# EAGLE design SIM908 (EAGLE 7.4.0)
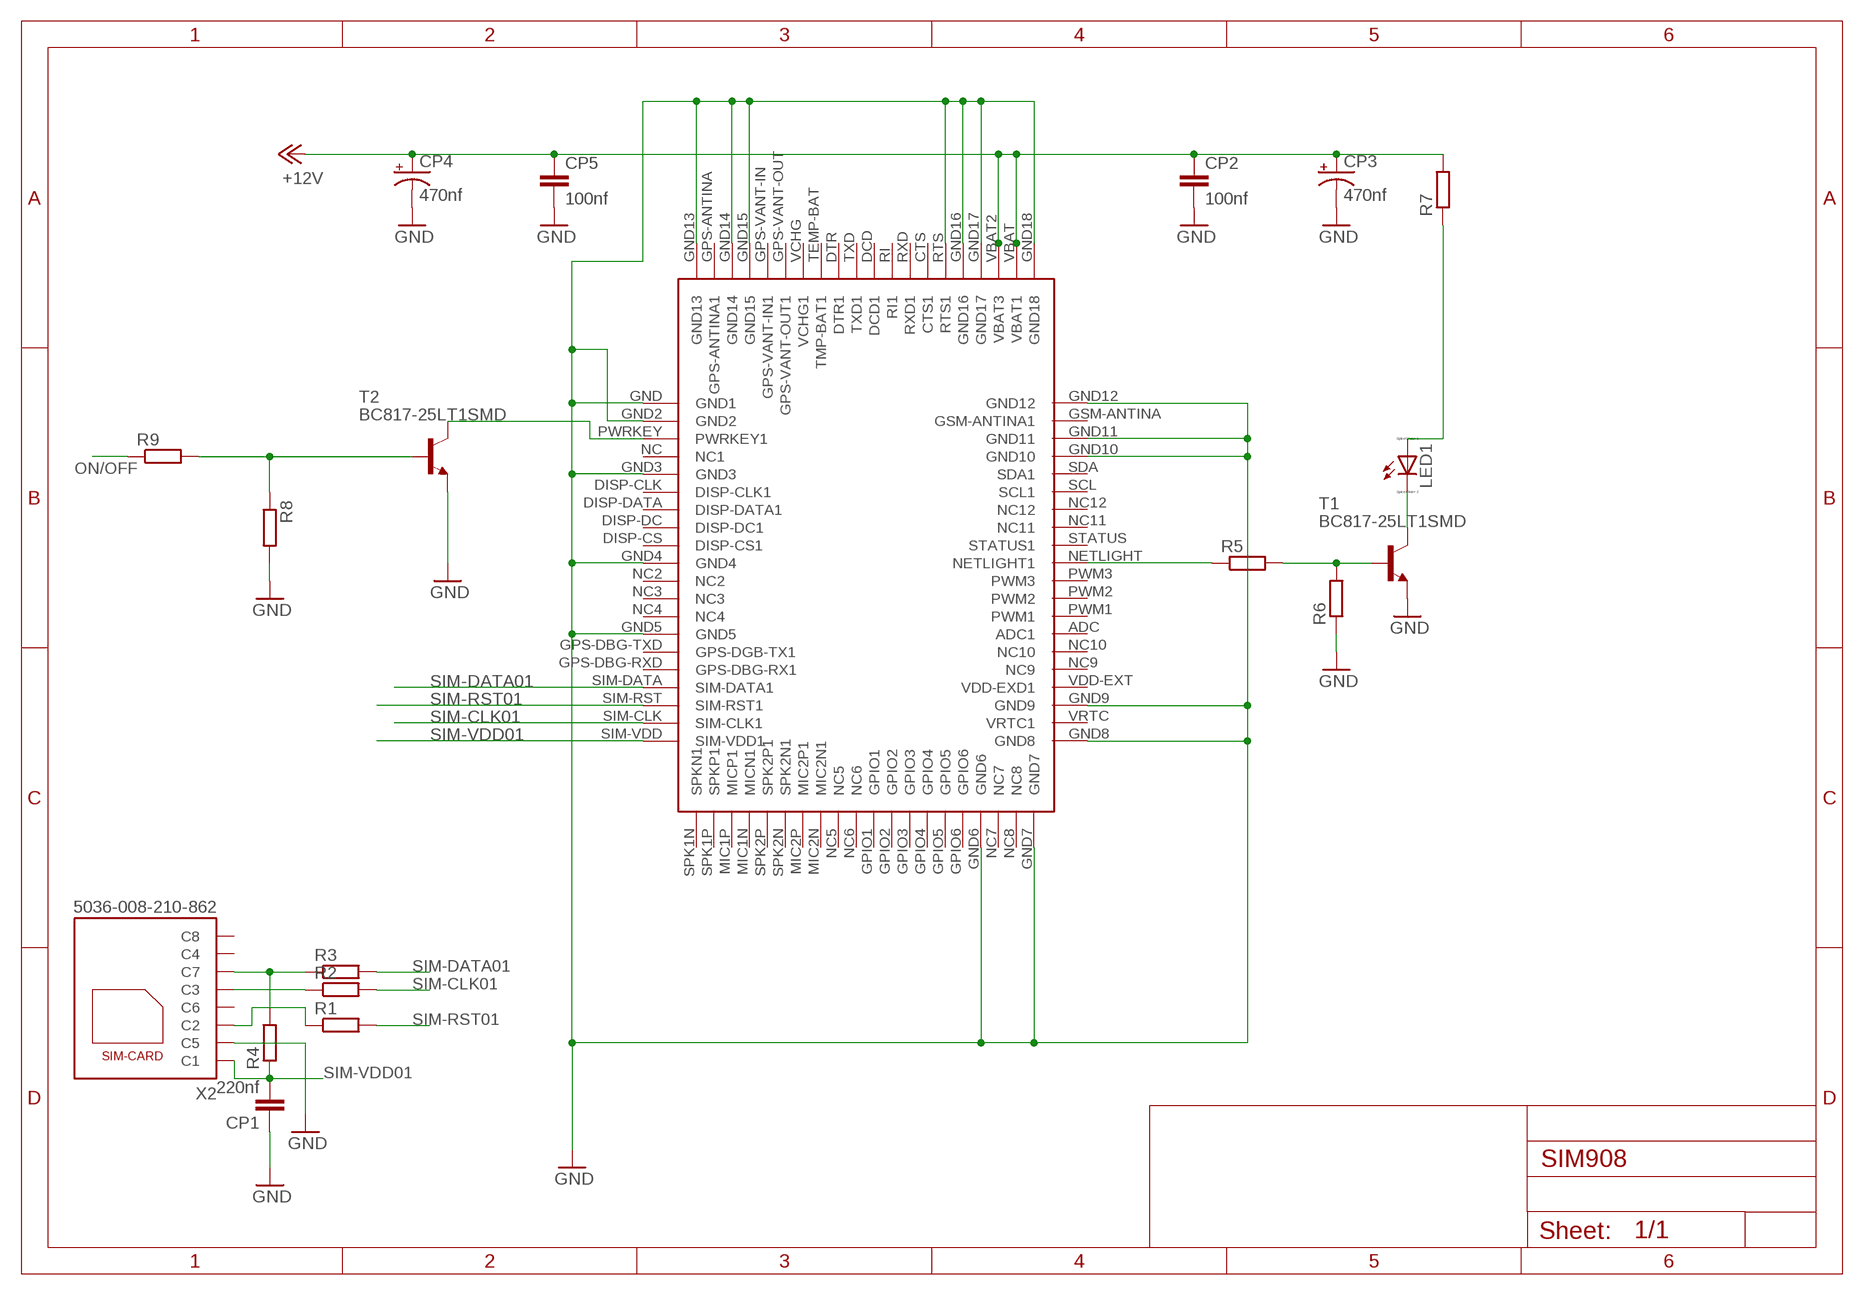
[diagram p0: schematic, sheet 1]

## Parts
CP1  220nf  C15/9  [C15B9]
CP2  100nf  C15/9  [C15B9]
CP3  470nf  CPOL-US153CLV-0807  [153CLV-0807]
CP4  470nf  CPOL-US153CLV-0807  [153CLV-0807]
CP5  100nf  C15/9  [C15B9]
LED1  LED_E  [LED_1206]
R1  R-EU_0207/12  [0207/12]
R2  R-EU_0207/12  [0207/12]
R3  R-EU_0207/12  [0207/12]
R4  R-EU_0207/12  [0207/12]
R5  R-EU_0207/12  [0207/12]
R6  R-EU_0207/12  [0207/12]
R7  R-EU_0207/12  [0207/12]
R8  R-EU_0207/12  [0207/12]
R9  R-EU_0207/12  [0207/12]
T1  BC817-25LT1SMD  [SOT23-BEC]
T2  BC817-25LT1SMD  [SOT23-BEC]
U$2  SIM908  [SIM908]
X2  5036-008-210-862  [5036_008_210_862]

## Nets
+12V: CP2.1 CP3.+ CP4.+ CP5.1 R7.2 U$2.VBAT2(VBAT3) U$2.VBAT(VBAT1)
GND: CP1.1 CP2.2 CP3.- CP4.- CP5.2 R6.1 R8.2 T1.E T2.E U$2.GND2 U$2.GND3 U$2.GND4 U$2.GND5 U$2.GND6 U$2.GND7 U$2.GND8 U$2.GND9 U$2.GND10 U$2.GND11 U$2.GND12 U$2.GND13 U$2.GND14 U$2.GND15 U$2.GND16 U$2.GND17 U$2.GND18 U$2.GND(GND1) U$2.RTS(RTS1) X2.C5
N$7: R2.1 X2.C3
N$9: R3.1 R4.2 X2.C7
N$10: R1.1 X2.C2
N$11: T2.C U$2.PWRKEY(PWRKEY1)
N$14: R8.1 R9.2 T2.B
N$16: R5.2 R6.2 T1.B
N$17: LED1.C T1.C
N$18: LED1.A R7.1
N$19: R5.1 U$2.NETLIGHT(NETLIGHT1)
ON/OFF: R9.1
SIM-CLK01: R2.2 U$2.SIM-CLK(SIM-CLK1)
SIM-DATA01: R3.2 U$2.SIM-DATA(SIM-DATA1)
SIM-RST01: R1.2 U$2.SIM-RST(SIM-RST1)
SIM-VDD01: CP1.2 R4.1 U$2.SIM-VDD(SIM-VDD1) X2.C1
Unconnected: U$2.ADC(ADC1) U$2.CTS(CTS1) U$2.DCD(DCD1) U$2.DISP-CLK(DISP-CLK1) U$2.DISP-CS(DISP-CS1) U$2.DISP-DATA(DISP-DATA1) U$2.DISP-DC(DISP-DC1) U$2.DTR(DTR1) U$2.GPIO1 U$2.GPIO2 U$2.GPIO3 U$2.GPIO4 U$2.GPIO5 U$2.GPIO6 U$2.GPS-ANTINA(GPS-ANTINA1) U$2.GPS-DBG-RXD(GPS-DBG-RX1) U$2.GPS-DBG-TXD(GPS-DGB-TX1) U$2.GPS-VANT-IN(GPS-VANT-IN1) U$2.GPS-VANT-OUT(GPS-VANT-OUT1) U$2.GSM-ANTINA(GSM-ANTINA1) U$2.MIC1N(MICN1) U$2.MIC1P(MICP1) U$2.MIC2N(MIC2N1) U$2.MIC2P(MIC2P1) U$2.NC2 U$2.NC3 U$2.NC4 U$2.NC5 U$2.NC6 U$2.NC7 U$2.NC8 U$2.NC9 U$2.NC10 U$2.NC11 U$2.NC12 U$2.NC(NC1) U$2.PWM1 U$2.PWM2 U$2.PWM3 U$2.RI(RI1) U$2.RXD(RXD1) U$2.SCL(SCL1) U$2.SDA(SDA1) U$2.SPK1N(SPKN1) U$2.SPK1P(SPKP1) U$2.SPK2N(SPK2N1) U$2.SPK2P(SPK2P1) U$2.STATUS(STATUS1) U$2.TEMP-BAT(TMP-BAT1) U$2.TXD(TXD1) U$2.VCHG(VCHG1) U$2.VDD-EXT(VDD-EXD1) U$2.VRTC(VRTC1) X2.C4 X2.C6 X2.C8

## Library data of the parts
CP1 CP2 CP5 = capacitor-wima:C: CAPACITOR naming: grid - package width
CP3 CP4 = rcl:CPOL-US: POLARIZED CAPACITOR, American symbol
LED1 = eagle-ltspice:LED_E: LED Source: http://www.osram.convergy.de Source: www.luxeon.com Source: www.kingbright.com; SPICEMODEL: NONE; SPICEPREFIX: D; SPICETYPE: diode
R1-R9 = resistor:R-EU_: RESISTOR, European symbol
T1 T2 = transistor-npn:BC817*: NPN Transistor
U$2 = sim908_-made_by_hardik:SIM908
X2 = con-kyocera-elco:5036-008-210-862: SIM Card Module Source: http://www.kyocera-elco.com/prdct/pdf/5036.pdf; OC_FARNELL: unknown; OC_NEWARK: unknown

## Board
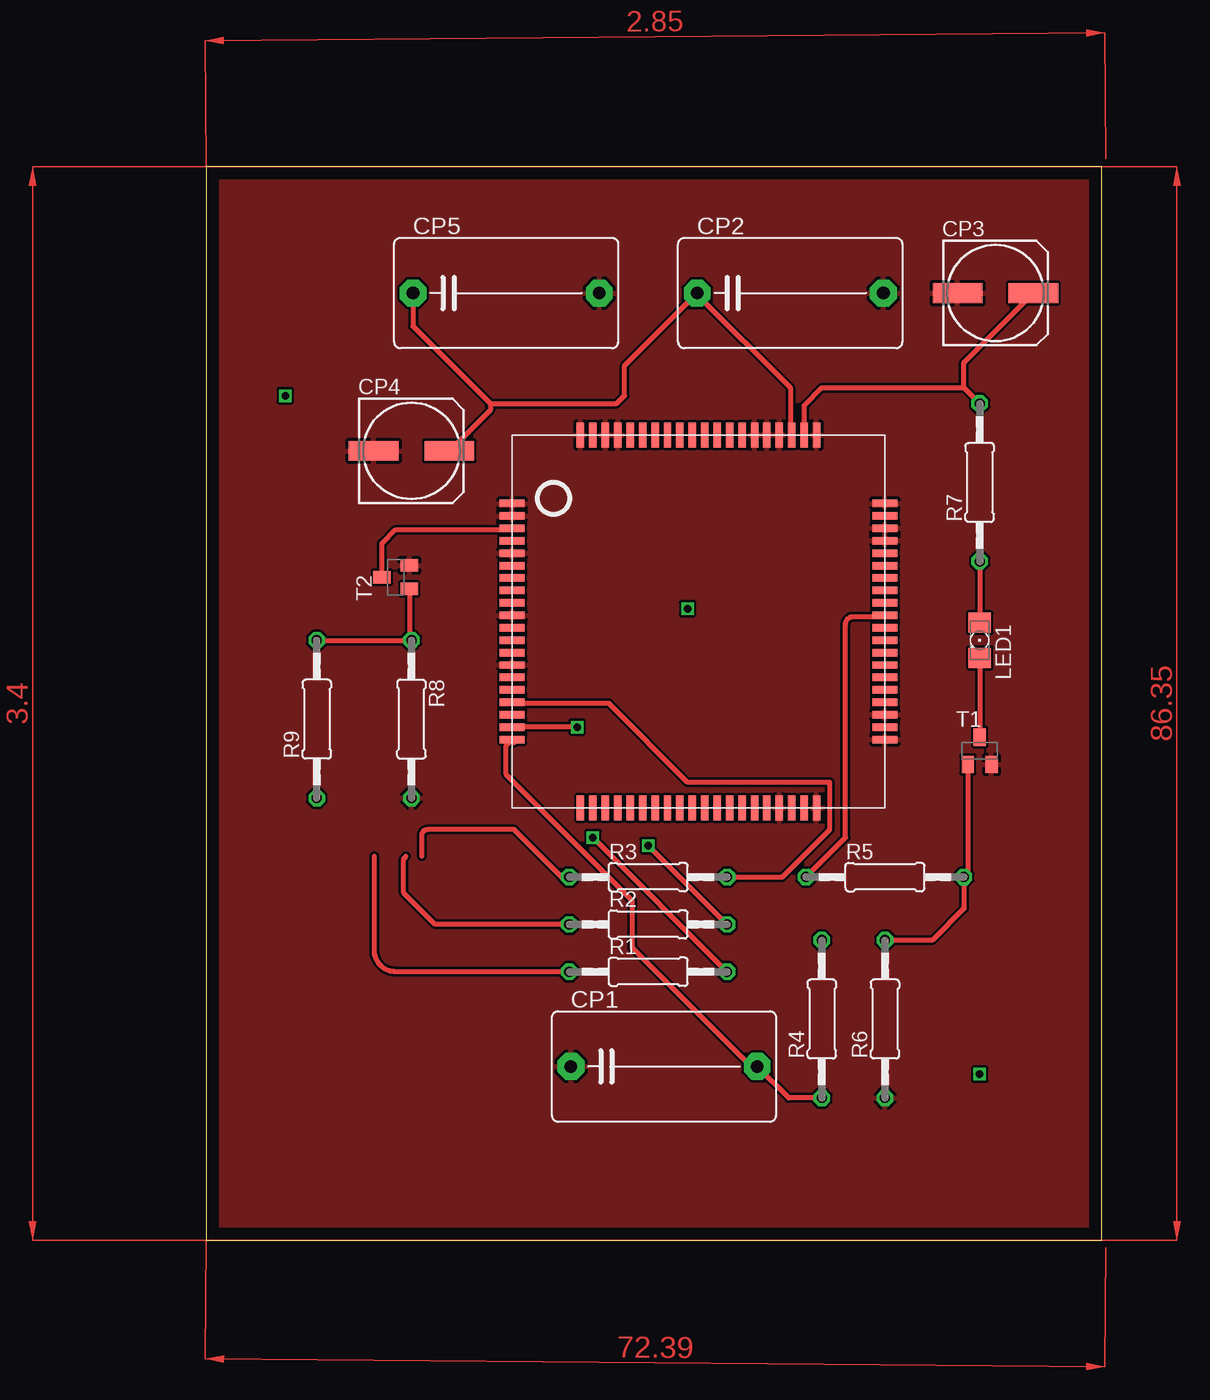
[diagram p1: board, top side]
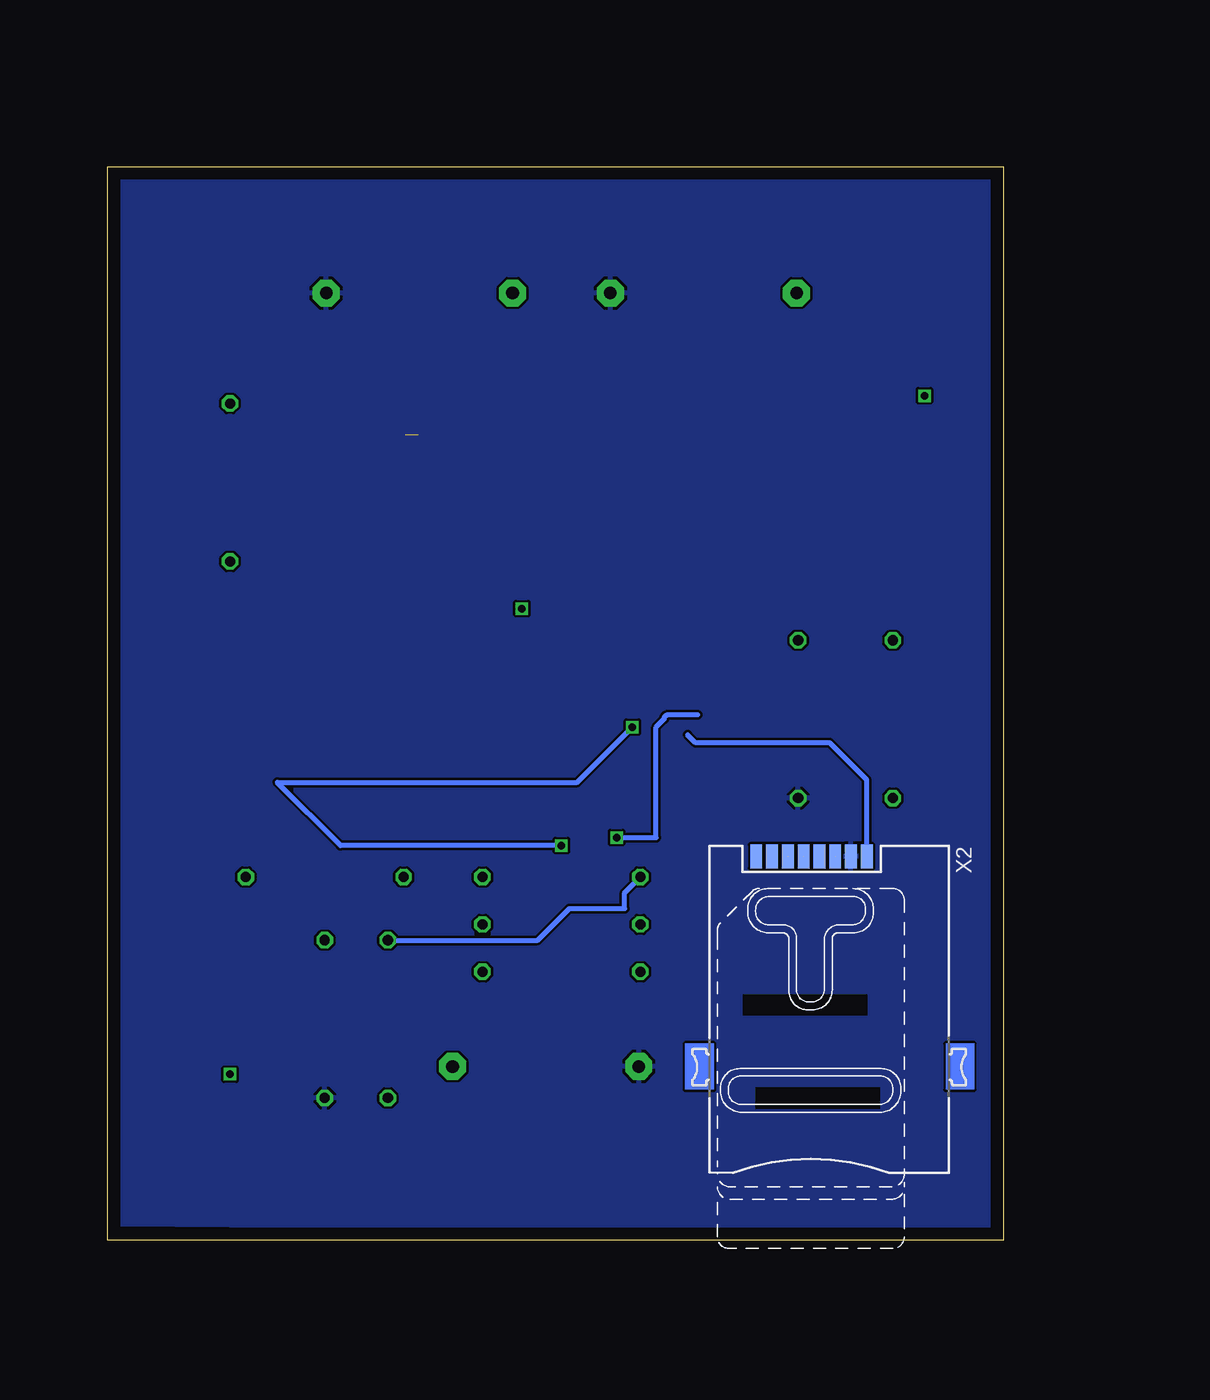
[diagram p2: board, bottom side, seen from below]

Size 72.06 x 86.35 mm. Coordinates in mm from the lower left corner, seen from the top.
Outline: 0,0 72.06,0 72.06,86.35 0,86.35 0,0
Copper layers (1*16): Top 0.035mm / dielectric 1.5mm / Bottom 0.035mm
Design rules "default *": minimum track width 10mil, minimum drill 20mil, track to track 8mil, track to pad 8mil, pad to pad 8mil, via to via 8mil, smd to smd 8mil, copper to edge 40mil, drill to drill 8mil, minimum pad ring 10mil, minimum via ring 8mil, stop-mask expansion 4mil, vias tented up to drill 0mil, thermal gap 10mil

### Footprints (pad centres in the part's own frame; a part is rotated, then mirrored left to right if it is on the bottom)
C15B9 = drill 1.016 pad 2.159 octagon: 1 -7.493,0; 2 7.493,0
153CLV-0807 = smd 4 x 1.6: + 3.05,0; - -3.05,0
LED_1206 = smd 1.6 x 1.803: A -1.422,0; C 1.422,0
0207/12 = drill 0.813 octagon: 1 -6.35,0; 2 6.35,0
SOT23-BEC = smd 1 x 1.4: B -0.95,-1.1; C 0,1.1; E 0.95,-1.1
SIM908 = smd 2 x 0.6: ADC 0,-18.5; DISP-CLK -30,-10.5; DISP-CS -30,-13.5; DISP-DATA -30,-11.5; DISP-DC -30,-12.5; GND -30,-5.5; GND2 -30,-6.5; GND3 -30,-9.5; GND4 -30,-14.5; GND5 -30,-18.5; GND8 0,-24.5; GND9 0,-22.5; GND10 0,-8.5; GND11 0,-7.5; GND12 0,-5.5; GPS-DBG-RXD -30,-20.5; GPS-DBG-TXD -30,-19.5; GSM-ANTINA 0,-6.5; NC -30,-8.5; NC2 -30,-15.5; NC3 -30,-16.5; NC4 -30,-17.5; NC9 0,-20.5; NC10 0,-19.5; NC11 0,-12.5; NC12 0,-11.5; NETLIGHT 0,-14.5; PWM1 0,-17.5; PWM2 0,-16.5; PWM3 0,-15.5; PWRKEY -30,-7.5; SCL 0,-10.5; SDA 0,-9.5; SIM-CLK -30,-23.5; SIM-DATA -30,-21.5; SIM-RST -30,-22.5; SIM-VDD -30,-24.5; STATUS 0,-13.5; VDD-EXT 0,-21.5; VRTC 0,-23.5 | smd 0.6 x 2: CTS -11.5,0; DCD -14.5,0; DTR -16.5,0; GND6 -8.5,-30; GND7 -5.5,-30; GND13 -24.5,0; GND14 -22.5,0; GND15 -21.5,0; GND16 -9.5,0; GND17 -8.5,0; GND18 -5.5,0; GPIO1 -14.5,-30; GPIO2 -13.5,-30; GPIO3 -12.5,-30; GPIO4 -11.5,-30; GPIO5 -10.5,-30; GPIO6 -9.5,-30; GPS-ANTINA -23.5,0; GPS-VANT-IN -20.5,0; GPS-VANT-OUT -19.5,0; MIC1N -21.5,-30; MIC1P -22.5,-30; MIC2N -17.5,-30; MIC2P -18.5,-30; NC5 -16.5,-30; NC6 -15.5,-30; NC7 -7.5,-30; NC8 -6.5,-30; RI -13.5,0; RTS -10.5,0; RXD -12.5,0; SPK1N -24.5,-30; SPK1P -23.5,-30; SPK2N -20.5,-30; SPK2P -19.5,-30; TEMP-BAT -17.5,0; TXD -15.5,0; VBAT -6.5,0; VBAT2 -7.5,0; VCHG -18.5,0
5036_008_210_862 = smd 1.9 x 0.95: C1 -16.9,2.98; C2 -16.9,0.44; C3 -16.9,-2.1; C4 -16.9,-4.64; C5 -16.9,1.71; C6 -16.9,-0.83; C7 -16.9,-3.37; C8 -16.9,-5.91

### Placement (x,y rotation side)
CP1  36.83,13.97 0 top
CP2  46.99,76.2 0 top
CP3  63.5,76.2 0 top
CP4  16.51,63.5 0 top
CP5  24.13,76.2 0 top
LED1  62.23,48.26 270 top
R1  35.56,21.59 0 top
R2  35.56,25.4 0 top
R3  35.56,29.21 0 top
R4  49.53,17.78 90 top
R5  54.61,29.21 0 top
R6  54.61,17.78 90 top
R7  62.23,60.96 90 top
R8  16.51,41.91 270 top
R9  8.89,41.91 90 top
T1  62.23,39.37 0 top
T2  15.24,53.34 90 top
U$2  54.61,64.77 0 top
X2  13.97,13.97 270 bottom

### Tracks (layer width: path | path; a pad name or v marks a point on that pad's centre or on a via)
+12V  (1 unrouted)
  Top 0.406: CP5.1 16.64,73.53 22.86,67.31 | 22.86,67.31 22.86,66.8 CP4.+ | 22.86,67.31 33.02,67.31 33.66,67.95 33.66,70.36 CP2.1 39.5,76.07 46.99,68.58 46.99,64.89 U$2.VBAT2 | U$2.VBAT 48.11,67.16 49.53,68.58 60.96,68.58 | 60.96,68.58 R7.2 | 60.96,68.58 60.96,70.61 CP3.+
GND
  Bottom 0.406: X2.C5 12.26,30.68 12.07,30.48
  pour Top: -29.21,92.71 123.19,92.71 123.19,29.21 123.19,-6.35 -29.21,-6.35
  pour Bottom: -0.63,85.73 0,0.63 71.12,1.27 72.39,87
N$1  (via drill 0.6)
  other vias: 62.23,13.34
N$2  (via drill 0.6)
  other vias: 38.73,50.8
N$3  (via drill 0.6)
  other vias: 6.35,67.95
N$7  (1 unrouted)
  Top 0.406: R2.1 18.41,25.4 15.88,27.94 15.88,30.68 X2.C3
N$9  (1 unrouted)
  Top 0.406: R3.1 28.57,29.21 24.77,33.02 17.78,33.02 arc90 17.34,32.58 X2.C7
  Bottom 0.406: R4.2 37.47,24.13 34.92,26.67 30.48,26.67 30.48,27.94 R3.1
N$10  (1 unrouted)
  Top 0.406: R1.1 15.24,21.59 arc-90 13.53,23.3 X2.C2
N$11
  Top 0.406: T2.C 14.14,56.05 15.24,57.15 24.49,57.15 U$2.PWRKEY
N$14
  Top 0.406: T2.B 16.34,48.43 R8.1 R9.2
N$16
  Top 0.406: T1.B 61.28,29.53 R5.2 60.96,26.67 58.42,24.13 R6.2
N$17
  Top 0.406: LED1.C T1.C
N$18
  Top 0.406: R7.1 LED1.A
N$19
  Top 0.406: R5.1 51.44,32.38 51.44,49.53 arc-90 52.07,50.16 53.97,50.16 arc-90 54.08,50.27 U$2.NETLIGHT
SIM-CLK01  (via drill 0.6)
  Top 0.406: R2.2 v35.56,31.75 | v29.85,41.27 U$2.SIM-CLK
  Bottom 0.406: v35.56,31.75 53.34,31.75 58.42,36.83 34.29,36.83 v29.85,41.27
SIM-DATA01
  Top 0.406: R3.2 46.36,29.21 50.17,33.02 50.17,36.83 38.73,36.83 32.39,43.18 24.7,43.18 U$2.SIM-DATA
SIM-RST01  (via drill 0.6)  (1 unrouted)
  Top 0.406: R1.2 v31.11,32.38
  Bottom 0.406: v31.11,32.38 27.94,32.38 27.94,41.27 27.31,41.91 arc90 26.95,42.27 U$2.SIM-RST
SIM-VDD01  (1 unrouted)
  Top 0.406: R4.1 46.86,11.43 CP1.2 43.81,13.97 34.29,23.5 34.29,27.3 24.13,37.46 24.13,39.79 U$2.SIM-VDD 24.61,40.16 24.77,40
  Bottom 0.406: X2.C1 10.99,37.02 13.97,40 24.77,40 25.4,40.64
(copper drawn outside any net)
  shapes: Top area x4